# Altium schematic sheet LED_Feedback.SchDoc
size A; SheetNumber: 5; SheetTotal: 5
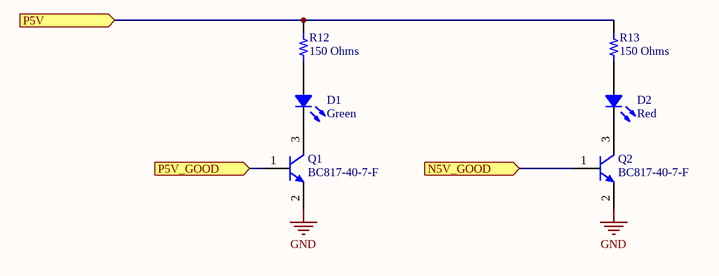
[diagram p0: LED_Feedback.SchDoc]

## Parts
D1  Green  [LED 0805_2012 GREEN]
D2  Red  [LED 0805_2012 RED]
Q1  BC817-40-7-F  [DIODES SOT-23-3]
Q2  BC817-40-7-F  [DIODES SOT-23-3]
R12  150 Ohms  [RES 1206_3216]
R13  150 Ohms  [RES 1206_3216]

## Ports
N5V_GOOD (in), P5V (in), P5V_GOOD (in)

## Nets
GND: Q1.2(E) Q2.2(E)
N5V_GOOD: Q2.1(B) ; port N5V_GOOD
P5V: R12.2 R13.2 ; port P5V
P5V_GOOD: Q1.1(B) ; port P5V_GOOD
NetD1_1: D1.1 R12.1
NetD1_2: D1.2 Q1.3(C)
NetD2_1: D2.1 R13.1
NetD2_2: D2.2 Q2.3(C)

## Library data of the parts
D1 = CMD17-21VGD/TR8: LED GREEN DIFFUSED 0805 SMD; Manufacturer: Visual Communications Company - VCC; Configuration: Standard; Current - Test: 20mA; Lens Size: 1.40mm x 1.25mm; Lens Style: Rectangle with Flat Top; Millicandela Rating: 7mcd; Viewing Angle: 140°; Voltage - Forward (Vf) (Typ): 2.1V; Wavelength - Peak: 570nm; Part Number: CMD17-21VGD/TR8; Color: Green; ComponentLink1Description: Datasheet; ComponentLink1URL: https://vcclite.com/wp-content/uploads/wpallimport/files/files/CMD1721Seriesver3.pdf; ComponentLink2Description: DigiKey Link; ComponentLink2URL: https://www.digikey.com/en/products/detail/visual-communications-company-vcc/CMD17-21VGD-TR8/254855; Device Package: 0805 (2012 Metric); Height (Max): 1.20mm; LastUpdated: 7/12/2023 8:17:31 PM; Lens Color: Green; Lens Transparency: Diffused; Lifecycle Status: Active; Minimum Order: 1; Mounting Type: Surface Mount; Package / Case: 0805 (2012 Metric); Packaging: TapeAndReel; PartId: 299; Part Status: Active; Price: 0.19; Series: CMD17-21; Size / Dimension: 2.00mm L x 1.25mm W; Supplier 1: DigiKey; Supplier Part Number 1: L62505CT-ND; Supplier Device Package: 0805; Value: Green
D2 = CMD17-21VRD/TR8: LED RED DIFFUSED 0805 SMD; Manufacturer: Visual Communications Company - VCC; Configuration: Standard; Current - Test: 20mA; Lens Size: 1.40mm x 1.25mm; Lens Style: Rectangle with Flat Top; Millicandela Rating: 6mcd; Viewing Angle: 140°; Voltage - Forward (Vf) (Typ): 2V; Wavelength - Peak: 640nm; Part Number: CMD17-21VRD/TR8; Color: Red; ComponentLink1Description: Datasheet; ComponentLink1URL: https://vcclite.com/wp-content/uploads/wpallimport/files/files/CMD1721Seriesver3.pdf; ComponentLink2Description: DigiKey Link; ComponentLink2URL: https://www.digikey.com/en/products/detail/visual-communications-company-vcc/CMD17-21VRD-TR8/254853; Device Package: 0805 (2012 Metric); Height (Max): 1.20mm; LastUpdated: 7/12/2023 8:17:11 PM; Lens Color: Red; Lens Transparency: Diffused; Lifecycle Status: Active; Minimum Order: 1; Mounting Type: Surface Mount; Package / Case: 0805 (2012 Metric); Packaging: TapeAndReel; PartId: 366; Part Status: Active; Price: 0.21; Series: CMD17-21; Size / Dimension: 2.00mm L x 1.25mm W; Supplier 1: DigiKey; Supplier Part Number 1: L62501CT-ND; Supplier Device Package: 0805; Value: Red
Q1 Q2 = BC817-40-7-F: TRANS NPN 45V 0.5A SOT23-3; Manufacturer: Diodes Incorporated; Current - Collector Cutoff (Max): 100nA; Current - Collector (Ic) (Max): 500 mA; DC Current Gain (hFE) (Min) @ Ic, Vce: 250 @ 100mA, 1V; Frequency - Transition: 100MHz; Power - Max: 310 mW; Vce Saturation (Max) @ Ib, Ic: 700mV @ 50mA, 500mA; Part Number: BC817-40-7-F; ComponentLink1Description: Datasheet; ComponentLink1URL: https://www.diodes.com/assets/Datasheets/ds11107.pdf; ComponentLink2Description: DigiKey Link; ComponentLink2URL: https://www.digikey.com/en/products/detail/diodes-incorporated/BC817-40-7-F/814998; LastUpdated: 8/6/2023 9:15:11 PM; Lifecycle Status: Active; Minimum Order: 1; Mounting Type: Surface Mount; Operating Temperature: -65°C ~ 150°C (TJ); Package / Case: TO-236-3, SC-59, SOT-23-3; Packaging: TapeAndReel; PartId: 116; Part Status: Active; Price: 0.02; Series: Automotive, AEC-Q101; Supplier 1: DigiKey; Supplier Part Number 1: BC817-40FDICT-ND; Supplier Device Package: SOT-23-3; Transistor Type: NPN; Voltage - Collector Emitter Breakdown (Max): 45 V
R12 R13 = RT1206FRE07150RL: RES SMD 150 OHM 1% 1/4W 1206; Manufacturer: Yageo; Power (Watts): 0.25W, 1/4W; Temperature Coefficient: ±50ppm/°C; Part Number: RT1206FRE07150RL; ComponentLink1Description: Datasheet; ComponentLink1URL: https://www.yageo.com/upload/media/product/productsearch/datasheet/rchip/PYu-RT_1-to-0.01_RoHS_L_12.pdf; ComponentLink2Description: DigiKey Link; ComponentLink2URL: https://www.digikey.com/en/products/detail/yageo/RT1206FRE07150RL/1082930; Composition: Thin Film; Device Package: 1206 (3216 Metric); Height - Seated (Max): 0.026" (0.65mm); LastUpdated: 7/12/2023 7:42:26 PM; Lifecycle Status: Active; Minimum Order: 1; Number of Terminations: 2; Operating Temperature: -55°C ~ 155°C; Package / Case: 1206 (3216 Metric); Packaging: TapeAndReel; PartId: 66998; Part Status: Active; Price: 0.01; Resistance: 150 Ohms; Series: RT; Size / Dimension: 0.122" L x 0.063" W (3.10mm x 1.60mm); Supplier 1: DigiKey; Supplier Part Number 1: 13-RT1206FRE07150RLCT-ND; Supplier Device Package: 1206; Tolerance: ±1%; Value: 150 Ohms